# EAGLE design PCA9685-4conns (EAGLE 8.1.1)
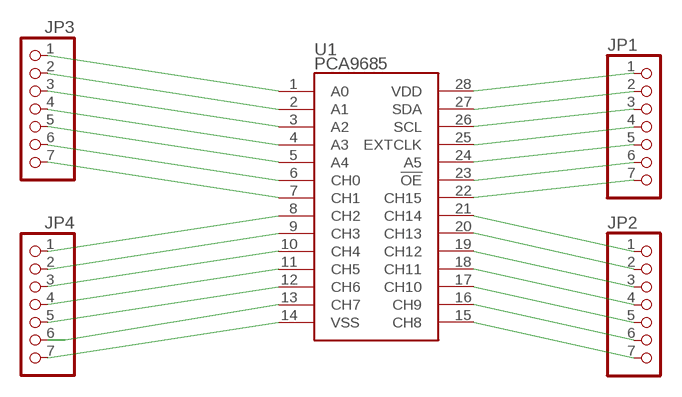
[diagram p0: schematic, sheet 1]

## Parts
JP1  PINHD-1X7  [1X07]
JP2  PINHD-1X7  [1X07]
JP3  PINHD-1X7  [1X07]
JP4  PINHD-1X7  [1X07]
U1  PCA9685  [TSSOP-28_4MM]

## Nets
N$1: JP3.1 U1.1(A0)
N$2: JP3.2 U1.2(A1)
N$3: JP3.3 U1.3(A2)
N$4: JP3.4 U1.4(A3)
N$5: JP3.5 U1.5(A4)
N$6: JP3.6 U1.6(CH0)
N$7: JP3.7 U1.7(CH1)
N$8: JP4.1 U1.8(CH2)
N$9: JP4.3 U1.10(CH4)
N$10: JP4.2 U1.9(CH3)
N$11: JP4.4 U1.11(CH5)
N$12: JP4.5 U1.12(CH6)
N$13: JP4.6 U1.13(CH7)
N$14: JP4.7 U1.14(VSS)
N$15: JP2.7 U1.15(CH8)
N$16: JP2.6 U1.16(CH9)
N$17: JP2.5 U1.17(CH10)
N$18: JP2.4 U1.18(CH11)
N$19: JP2.3 U1.19(CH12)
N$20: JP2.2 U1.20(CH13)
N$21: JP2.1 U1.21(CH14)
N$22: JP1.7 U1.22(CH15)
N$23: JP1.6 U1.23(!OE)
N$24: JP1.5 U1.24(A5)
N$25: JP1.4 U1.25(EXTCLK)
N$26: JP1.3 U1.26(SCL)
N$27: JP1.2 U1.27(SDA)
N$28: JP1.1 U1.28(VDD)

## Library data of the parts
JP1-JP4 = pinhead:PINHD-1X7: PIN HEADER
U1 = NXP:PCA9685: 16-channel 12-bit PWM I2C interface Internal Oscillator 40Hz to 1kHz Can be totem pole or open collector 2.3V to 5.5V; PROD_ID: IC-12240

## Board
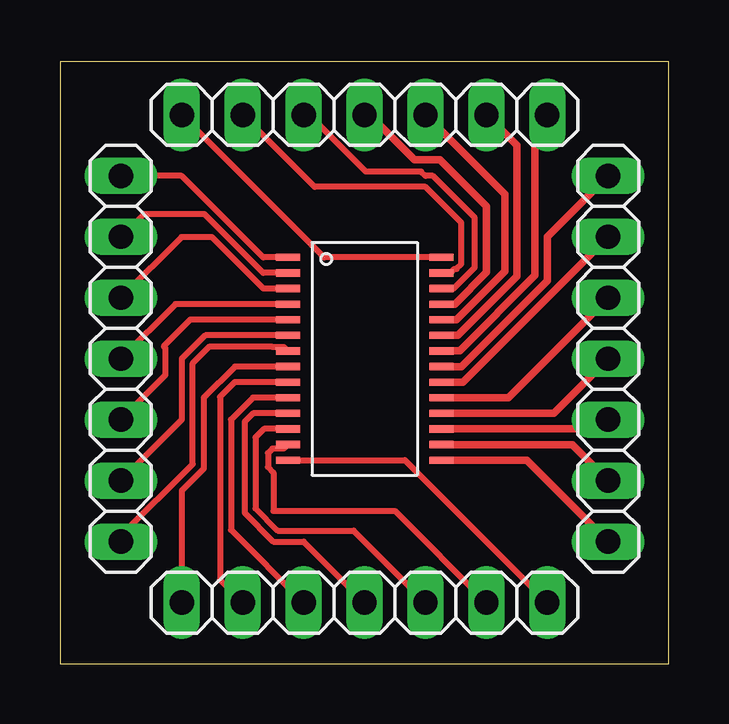
[diagram p1: board, top side]

Size 25.38 x 25.07 mm. Coordinates in mm from the lower left corner, seen from the top.
Outline: 0,0 25.38,0 25.38,25.07 0,25.07 0,0
Copper layers (1*16): Top 0.035mm / dielectric 1.5mm / Bottom 0.035mm
Design rules "default": minimum track width 10mil, minimum drill 24mil, track to track 8mil, track to pad 8mil, pad to pad 8mil, via to via 8mil, smd to smd 8mil, copper to edge 40mil, drill to drill 8mil, minimum pad ring 10mil, minimum via ring 8mil, stop-mask expansion 4mil, vias tented up to drill 0mil, thermal gap 10mil

### Footprints (pad centres in the part's own frame; a part is rotated, then mirrored left to right if it is on the bottom)
1X07 = drill 1.016 long: 1 -7.62,0; 2 -5.08,0; 3 -2.54,0; 4 0,0; 5 2.54,0; 6 5.08,0; 7 7.62,0
TSSOP-28_4MM = smd 1 x 0.3: 1 -3.2,4.225; 2 -3.2,3.575; 3 -3.2,2.925; 4 -3.2,2.275; 5 -3.2,1.625; 6 -3.2,0.975; 7 -3.2,0.325; 8 -3.2,-0.325; 9 -3.2,-0.975; 10 -3.2,-1.625; 11 -3.2,-2.275; 12 -3.2,-2.925; 13 -3.2,-3.575; 14 -3.2,-4.225; 15 3.2,-4.225; 16 3.2,-3.575; 17 3.2,-2.925; 18 3.2,-2.275; 19 3.2,-1.625; 20 3.2,-0.975; 21 3.2,-0.325; 22 3.2,0.325; 23 3.2,0.975; 24 3.2,1.625; 25 3.2,2.275; 26 3.2,2.925; 27 3.2,3.575; 28 3.2,4.225

### Placement (x,y rotation side)
JP1  12.7,22.86 0 top
JP2  22.86,12.7 270 top
JP3  2.54,12.7 270 top
JP4  12.7,2.54 0 top
U1  12.7,12.7 0 top

### Tracks (layer width: path | path; a pad name or v marks a point on that pad's centre or on a via)
N$1
  Top 0.254: U1.1 8.47,16.93 5.08,20.32 JP3.1
N$2
  Top 0.254: U1.2 8.48,16.27 6.03,18.73 3.49,18.73 JP3.2
N$3
  Top 0.254: U1.3 8.48,15.62 6.34,17.77 5.07,17.77 JP3.3
N$4
  Top 0.254: U1.4 4.82,14.97 JP3.4
N$5
  Top 0.254: U1.5 5.43,14.32 4.33,13.22 4.39,13.15 4.39,12.01 JP3.5
N$6
  Top 0.254: U1.6 6.05,13.68 5.08,12.7 5.08,10.16 JP3.6
N$7
  Top 0.254: JP3.7 2.54,5.31 5.54,8.31 5.54,12.51 6.24,13.22 8.84,13.22 8.86,13.2 9.33,13.2 U1.7
N$8
  Top 0.254: U1.8 7.29,12.38 5.99,11.07 5.99,8.12 5.08,7.21 JP4.1
N$9
  Top 0.254: U1.10 8.05,11.07 7.13,10.16 7.13,5.57 JP4.3
N$10
  Top 0.254: U1.9 7.29,11.72 6.67,11.11 6.67,3.49 JP4.2
N$11
  Top 0.254: U1.11 8.04,10.43 7.7,10.08 7.7,6.27 8.89,5.08 10.16,5.08 JP4.4
N$12
  Top 0.254: U1.12 8.51,9.78 8.16,9.43 8.16,6.46 9.08,5.54 12.24,5.54 JP4.5
N$13
  Top 0.254: U1.13 9.33,8.96 8.86,8.96 8.67,8.76 8.67,8.19 8.9,7.96 8.9,6.36 13.96,6.36 JP4.6
N$14
  Top 0.254: U1.14 14.38,8.47 JP4.7
N$15
  Top 0.305: JP2.7 19.46,8.47 U1.15
N$16
  Top 0.305: JP2.6 21.36,9.12 U1.16
N$17
  Top 0.305: JP2.5 22.48,9.78 U1.17
N$18
  Top 0.305: JP2.4 20.59,10.43 U1.18
N$19
  Top 0.305: JP2.3 18.7,11.07 U1.19
N$20
  Top 0.305: JP2.2 16.8,11.72 U1.20
N$21
  Top 0.305: JP2.1 20.32,17.78 20.32,15.96 16.74,12.38 U1.21
N$22
  Top 0.305: U1.22 16.67,13.03 19.81,16.17 19.81,22.35 JP1.7
N$23
  Top 0.305: JP1.6 19.05,21.59 19.05,16.12 16.6,13.68 U1.23
N$24
  Top 0.305: U1.24 16.53,14.32 18.54,16.34 18.54,19.56 JP1.5
N$25
  Top 0.305: U1.25 16.46,14.97 17.78,16.29 17.78,19.05 15.85,20.98 14.78,20.98 12.9,22.86 JP1.4
N$26
  Top 0.254: U1.26 16.41,15.62 17.3,16.51 17.3,18.57 15.54,20.32 15.24,20.32 15.06,20.5 12.76,20.5 10.39,22.86 JP1.3
N$27
  Top 0.254: U1.27 16.27,16.27 16.45,16.45 16.54,16.45 16.73,16.64 16.73,18.37 15.24,19.86 10.62,19.86 JP1.2
N$28
  Top 0.254: U1.28 11.02,16.93 JP1.1